# EAGLE design Attenuverting mixer mutes (EAGLE 7.7.0)
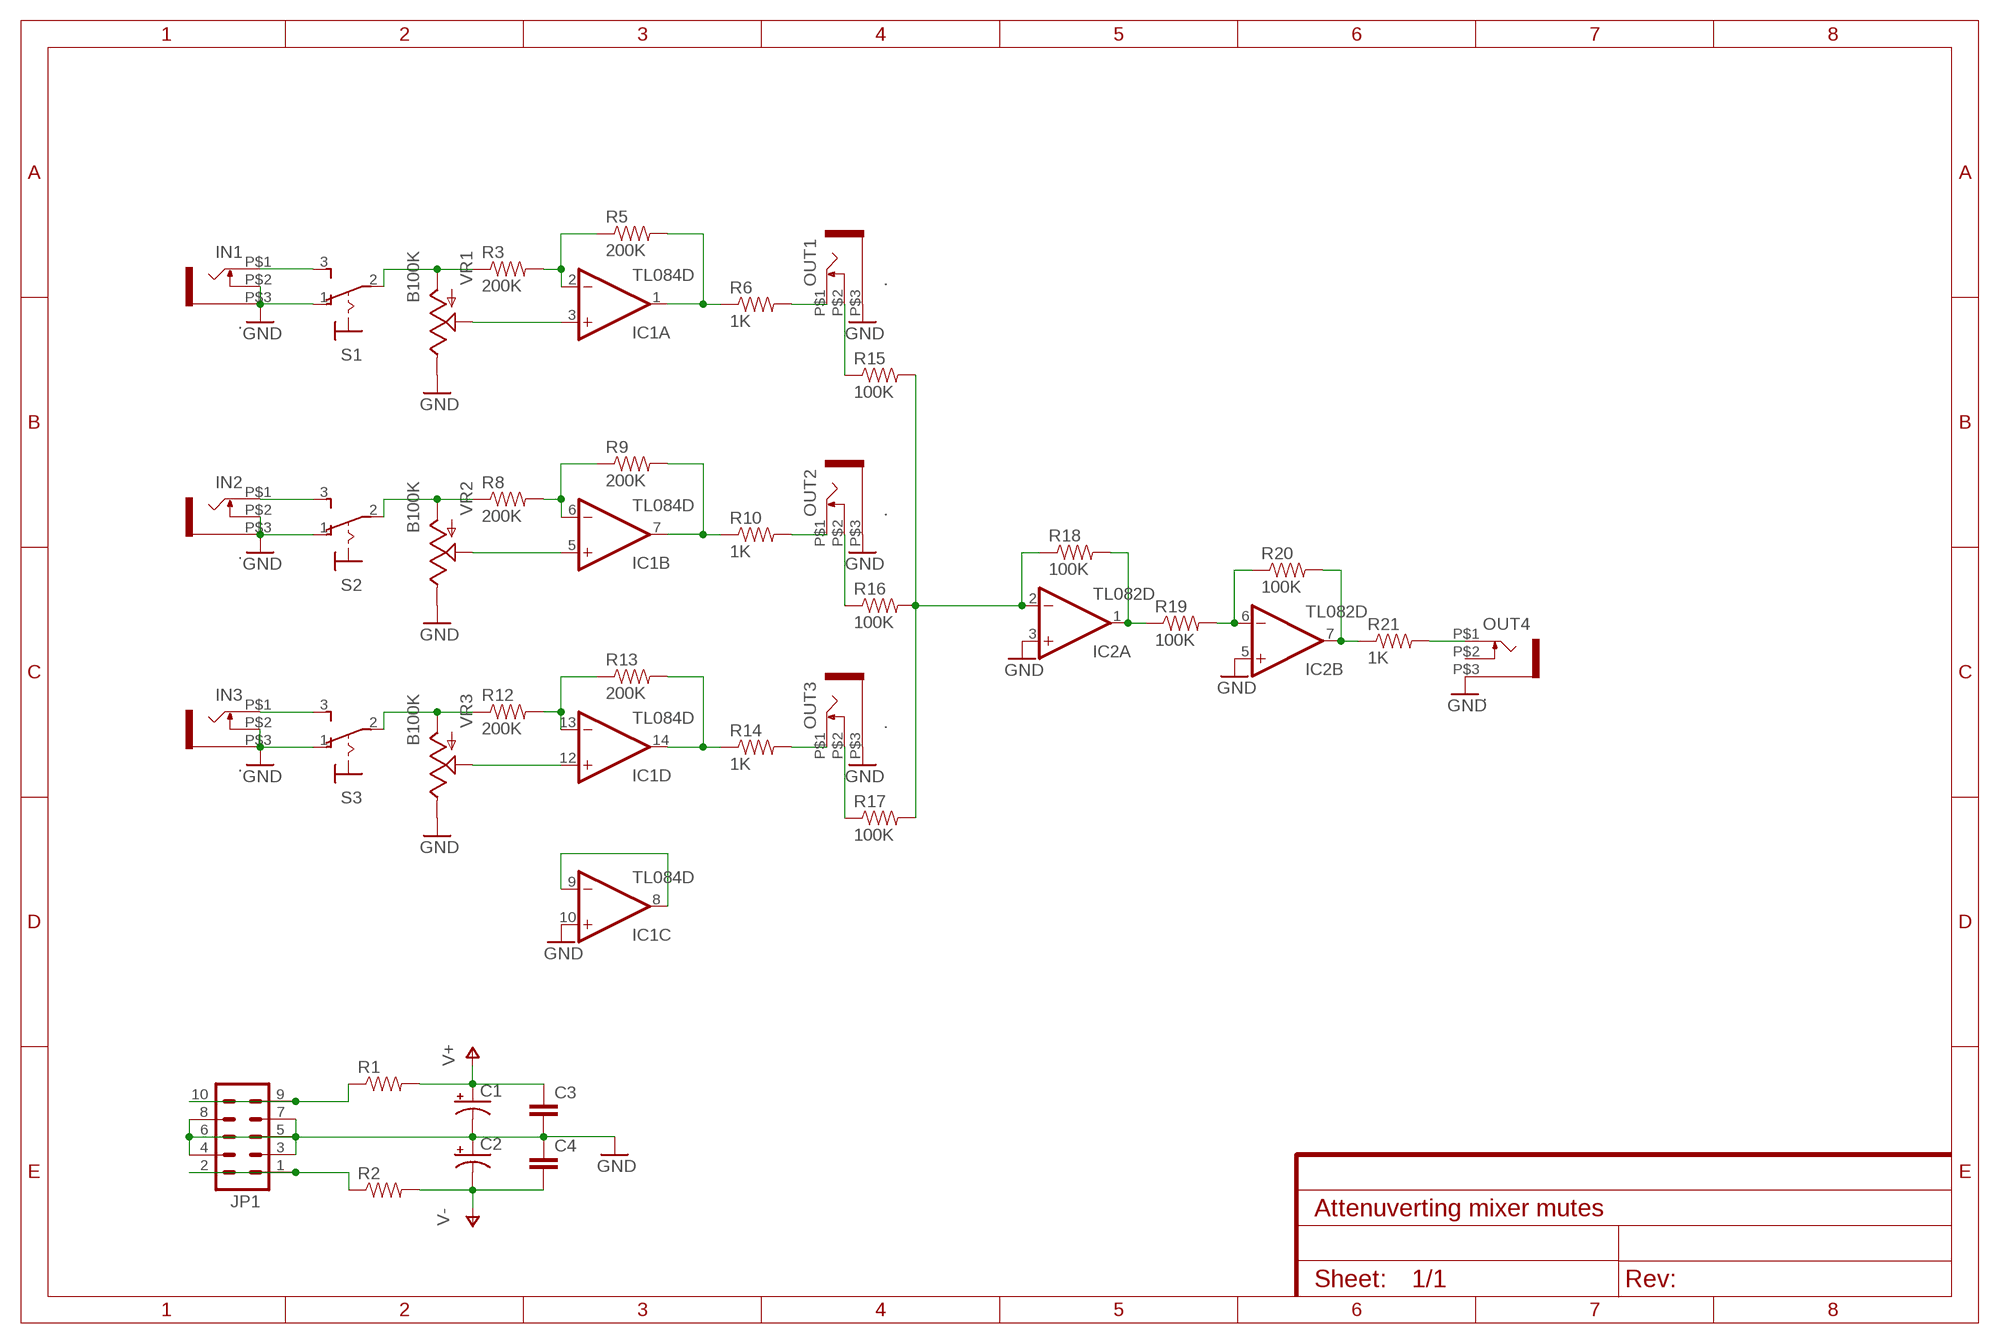
[diagram p0: schematic, sheet 1]

## Parts
C1  CAP_POLD  [PANASONIC_D]
C2  CAP_POLD  [PANASONIC_D]
C3  CAP0603-CAP  [0603-CAP]
C4  CAP0603-CAP  [0603-CAP]
IC1  TL084D  [SO14]
IC2  TL082D  [SO08]
IN1  .  WQP-PJ301M-12_JACK  [WQP-PJ301M-12_JACK]
IN2  .  WQP-PJ301M-12_JACK  [WQP-PJ301M-12_JACK]
IN3  .  WQP-PJ301M-12_JACK  [WQP-PJ301M-12_JACK]
JP1  M05X2PTH  [AVR_ICSP]
OUT1  .  WQP-PJ301M-12_JACK  [WQP-PJ301M-12_JACK]
OUT2  .  WQP-PJ301M-12_JACK  [WQP-PJ301M-12_JACK]
OUT3  .  WQP-PJ301M-12_JACK  [WQP-PJ301M-12_JACK]
OUT4  .  WQP-PJ301M-12_JACK  [WQP-PJ301M-12_JACK]
R1  RESISTOR0805-RES  [0805]
R2  RESISTOR0805-RES  [0805]
R3  200K  RESISTOR0603-RES  [0603-RES]
R5  200K  RESISTOR0603-RES  [0603-RES]
R6  1K  RESISTOR0603-RES  [0603-RES]
R8  200K  RESISTOR0603-RES  [0603-RES]
R9  200K  RESISTOR0603-RES  [0603-RES]
R10  1K  RESISTOR0603-RES  [0603-RES]
R12  200K  RESISTOR0603-RES  [0603-RES]
R13  200K  RESISTOR0603-RES  [0603-RES]
R14  1K  RESISTOR0603-RES  [0603-RES]
R15  100K  RESISTOR0603-RES  [0603-RES]
R16  100K  RESISTOR0603-RES  [0603-RES]
R17  100K  RESISTOR0603-RES  [0603-RES]
R18  100K  RESISTOR0603-RES  [0603-RES]
R19  100K  RESISTOR0603-RES  [0603-RES]
R20  100K  RESISTOR0603-RES  [0603-RES]
R21  1K  RESISTOR0603-RES  [0603-RES]
S1  M9040P  [M9040P]
S2  M9040P  [M9040P]
S3  M9040P  [M9040P]
VR1  B100K  POT  [ALPS_POT]
VR2  B100K  POT  [ALPS_POT]
VR3  B100K  POT  [ALPS_POT]

## Nets
GND: C1.- C2.+ C3.2 C4.1 IC1.10(C:+IN) IC2.3(A:+IN) IC2.5(B:+IN) IN1.P$2 IN1.P$3 IN2.P$2 IN2.P$3 IN3.P$2 IN3.P$3 JP1.3 JP1.4 JP1.5 JP1.6 JP1.7 JP1.8 OUT1.P$3 OUT2.P$3 OUT3.P$3 OUT4.P$3 S1.1(O) S2.1(O) S3.1(O) VR1.P$1(E) VR2.P$1(E) VR3.P$1(E)
N$1: R3.1 S1.2(P) VR1.P$3(A)
N$2: IC1.2(A:-IN) R3.2 R5.1
N$3: JP1.1 JP1.2 R2.1
N$4: JP1.9 JP1.10 R1.1
N$5: OUT3.P$1 R14.2
N$6: OUT2.P$1 R10.2
N$7: OUT1.P$1 R6.2
N$8: IC1.1(A:OUT) R5.2 R6.1
N$9: IC1.3(A:+IN) VR1.P$2(S)
N$10: R8.1 S2.2(P) VR2.P$3(A)
N$11: IC1.6(B:-IN) R8.2 R9.1
N$12: IC1.5(B:+IN) VR2.P$2(S)
N$13: IC1.7(B:OUT) R9.2 R10.1
N$14: R12.1 S3.2(P) VR3.P$3(A)
N$15: IC1.12(D:+IN) VR3.P$2(S)
N$16: IC1.13(D:-IN) R12.2 R13.1
N$17: IC1.14(D:OUT) R13.2 R14.1
N$18: OUT1.P$2 R15.1
N$19: OUT2.P$2 R16.1
N$20: OUT3.P$2 R17.1
N$21: IC2.2(A:-IN) R15.2 R16.2 R17.2 R18.1
N$22: IC2.1(A:OUT) R18.2 R19.1
N$23: IC2.6(B:-IN) R19.2 R20.1
N$24: IC2.7(B:OUT) R20.2 R21.1
N$25: OUT4.P$1 R21.2
N$26: IC1.8(C:OUT) IC1.9(C:-IN)
N$27: IN3.P$1 S3.3(S)
N$28: IN2.P$1 S2.3(S)
N$31: IN1.P$1 S1.3(S)
V+: C1.+ C3.1 R1.2
V-: C2.- C4.2 R2.2
Unconnected: OUT4.P$2

## Power pins joined to a net without a drawn wire
V+: IC1.4(P:V+) IC2.8(P:V+)
V-: IC1.11(P:V-) IC2.4(P:V-)

## Library data of the parts
C1 C2 = SparkFun-Capacitors:CAP_POL: Capacitor Polarized These are standard SMD and PTH capacitors. Normally 10uF, 47uF, and 100uF in electrolytic and tantalum varieties. Always verify the external diameter of the through hole cap, it varies with capacity, voltage, and manufacturer. The EIA devices should be standard.
C3 C4 = SparkFun-Passives:CAP: Capacitor Standard 0603 ceramic capacitor, and 0.1" leaded capacitor.
IC1 = linear:TL084: OP AMP
IC2 = linear:TL082: OP AMP Data sheet <http://www.ti.com/lit/ds/symlink/tl084a . pdf>; DATA_SHEET: <a href="http://www.ti.com/lit/ds/symlink/tl084a.pdf"> Data sheet </a>
IN1-IN3 OUT1-OUT4 = thonkiconn:WQP-PJ301M-12_JACK
JP1 = SparkFun-Connectors:M05X2: Header 5x2 Standard 10-pin dual row 0.1" header. Commonly used with AVR-ISP. Use with Spark Fun Electronics SKU: PRT-00778
R1 R2 = SparkFun-Resistors:RESISTOR: Resistor Basic schematic elements and footprints for 0603, 1206, and PTH resistors.
R3 R5 R6 R8-R10 R12-R21 = SparkFun-Passives:RESISTOR: Resistor Basic schematic elements and footprints for 0603, 1206, and PTH resistors.
S1-S3 = switch:M9040P: TOGGLE SWITCH Marquardt
VR1-VR3 = SparkFun-Electromechanical:POT; PROD_ID: RES-09177

## Board
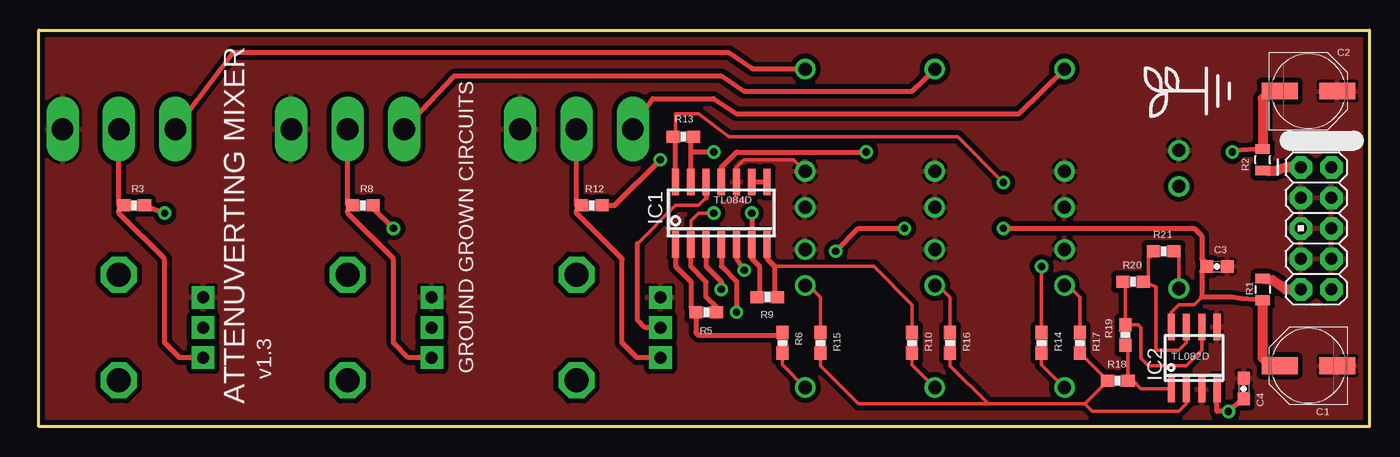
[diagram p1: board, top side]
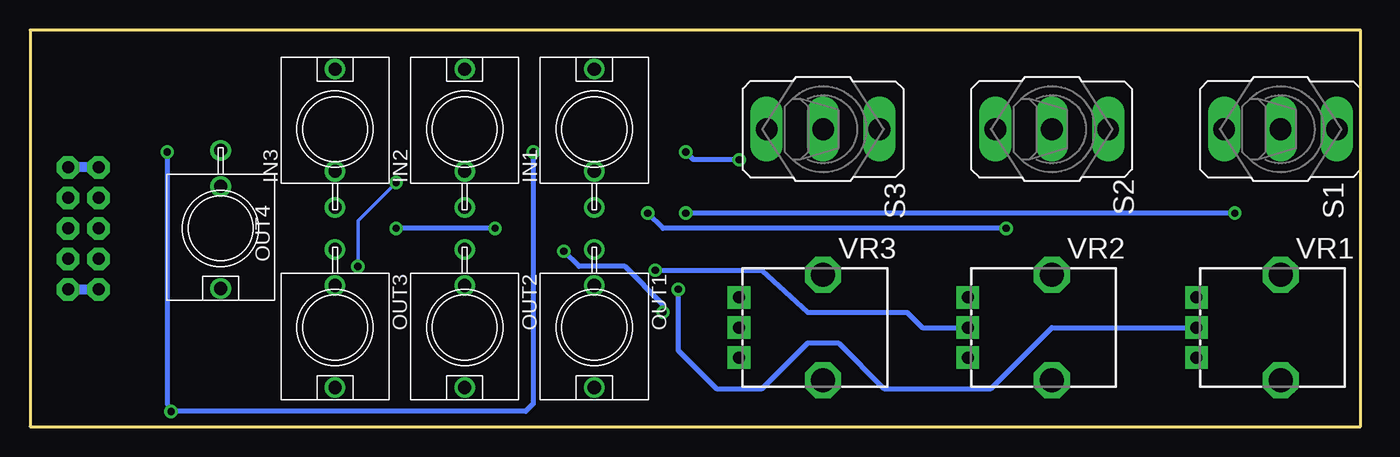
[diagram p2: board, bottom side, seen from below]

Size 110.81 x 33.02 mm. Coordinates in mm from the lower left corner, seen from the top.
Outline: 0,0 0,33.02 110.81,33.02 110.81,0 0,0
Copper layers (1*16): Top 0.035mm / dielectric 1.5mm / Bottom 0.035mm
Design rules "SparkFun": minimum track width 8mil, minimum drill 20mil, track to track 8mil, track to pad 8mil, pad to pad 8mil, via to via 8mil, smd to smd 8mil, copper to edge 8mil, drill to drill 8mil, minimum pad ring 12mil, minimum via ring 10mil, stop-mask expansion 4mil, vias tented up to drill 20mil, thermal gap 10mil

### Footprints (pad centres in the part's own frame; a part is rotated, then mirrored left to right if it is on the bottom)
PANASONIC_D = smd 3 x 1.4: + 2.4,0; - -2.4,0
0603-CAP = smd 1.1 x 1: 1 -0.85,0; 2 0.85,0
SO14 = smd 0.6 x 2.2: 1 -3.81,-2.6; 2 -2.54,-2.6; 3 -1.27,-2.6; 4 0,-2.6; 5 1.27,-2.6; 6 2.54,-2.6; 7 3.81,-2.6; 8 3.81,2.6; 9 2.54,2.6; 10 1.27,2.6; 11 0,2.6; 12 -1.27,2.6; 13 -2.54,2.6; 14 -3.81,2.6
SO08 = smd 0.6 x 2.2: 1 -1.905,-2.6; 2 -0.635,-2.6; 3 0.635,-2.6; 4 1.905,-2.6; 5 1.905,2.6; 6 0.635,2.6; 7 -0.635,2.6; 8 -1.905,2.6
WQP-PJ301M-12_JACK = drill 1.1: P$1 0,5; P$2 0,-3.5; P$3 0,-6.5
AVR_ICSP = drill 1.016 pad 1.88 octagon: 1 -1.27,5.08; 2 1.27,5.08; 3 -1.27,2.54; 4 1.27,2.54; 5 -1.27,0; 6 1.27,0; 7 -1.27,-2.54; 8 1.27,-2.54; 9 -1.27,-5.08; 10 1.27,-5.08
0805 = smd 0.8 x 1.2: 1 -0.9,0; 2 0.9,0
0603-RES = smd 1.1 x 1: 1 -0.85,0; 2 0.85,0
M9040P = drill 1.803 long: 1 0,4.699; 2 0,0; 3 0,-4.699
ALPS_POT = drill 1 pad 1.88 square: P$1 7,-2.5; P$2 7,0; P$3 7,2.5 | drill 2 octagon: P$4 0,-4.4; P$5 0,4.4

### Placement (x,y rotation side)
C1  105.73,5.08 180 top
C2  105.73,27.94 0 top
C3  98.11,13.34 0 top
C4  100.33,3.17 270 top
IC1  56.83,17.78 0 top
IC2  96.2,5.71 0 top
IN1  63.82,24.77 0 bottom
IN2  74.61,24.77 0 bottom
IN3  85.41,24.77 0 bottom
JP1  106.36,16.51 0 top
OUT1  63.82,8.26 180 bottom
OUT2  74.61,8.26 180 bottom
OUT3  85.41,8.26 180 bottom
OUT4  94.93,16.51 180 bottom
R1  101.92,11.43 270 top
R2  101.92,22.23 90 top
R3  7.94,18.41 0 top
R5  55.56,9.53 180 top
R6  61.91,6.99 270 top
R8  26.99,18.41 0 top
R9  60.64,10.79 0 top
R10  72.71,6.99 270 top
R12  46.04,18.41 0 top
R13  53.66,24.13 180 top
R14  83.5,6.99 270 top
R15  65.09,6.99 270 top
R16  75.88,6.99 270 top
R17  86.68,6.99 270 top
R18  89.85,3.81 0 top
R19  90.49,7.62 90 top
R20  91.12,12.06 0 top
R21  93.66,14.61 0 top
S1  6.67,24.77 270 bottom
S2  25.72,24.77 270 bottom
S3  44.77,24.77 270 bottom
U$1  [LOGO_SMALL]  97.16,27.94 90 top
VR1  6.67,8.26 180 bottom
VR2  25.72,8.26 180 bottom
VR3  44.77,8.26 180 bottom

### Tracks (layer width: path | path; a pad name or v marks a point on that pad's centre or on a via)
GND
  Top 0.305: IC1.10 58.1,21.59 58.74,22.23 62.86,22.23 IN1.P$2
  pour Top (isolate 0.406): 0.32,0 0.32,33.02 110.81,33.02 110.81,0
N$1
  Top 0.406: VR1.P$3 11.71,5.75 10.48,6.99 10.48,13.97 6.67,17.78 6.67,18 R3.1 6.67,18.41 S1.2
N$2  (via drill 0.6)
  Top 0.305: IC1.2 54.29,17.14 54.93,17.78 v56.2,17.78
  Top 0.406: R3.2 v10.48,17.78 | R5.1 56.41,9.95 55.56,10.79 55.56,12.06 54.29,13.34 IC1.2
  Bottom 0.406: v10.48,17.78 v56.2,17.78
N$3
  Top 0.813: JP1.1 103.82,21.59 102.87,21.27 102.36,21.27 R2.1
  Bottom 0.813: JP1.1 JP1.2
N$4
  Top 0.813: R1.1 102.74,12.2 103.82,11.43 JP1.9
  Bottom 0.813: JP1.10 JP1.9
N$5
  Top 0.305: R14.2 83.5,5.16 OUT3.P$1
N$6
  Top 0.305: R10.2 72.71,5.16 OUT2.P$1
N$7
  Top 0.305: R6.2 61.91,5.16 OUT1.P$1
N$8
  Top 0.406: IC1.1 53.02,13.34 54.29,12.06 54.29,9.95 R5.2 54.71,7.83 54.93,7.62 61.7,7.62 R6.1
N$9  (via drill 0.6)
  Top 0.406: IC1.3 55.56,13.34 56.83,12.06 v56.83,11.43
  Bottom 0.406: v56.83,11.43 56.83,6.35 53.66,3.17 49.85,3.17 46.04,6.99 43.5,6.99 39.69,3.17 30.8,3.17 25.72,8.26 VR1.P$2
N$10
  Top 0.406: VR2.P$3 30.76,5.75 29.53,6.99 29.53,13.97 25.72,17.78 25.72,18 R8.1 25.72,18.41 S2.2
N$11  (via drill 0.6)
  Top 0.406: R9.1 60.01,11.01 60.01,13.34 59.37,13.97 IC1.6 v59.37,17.78 | R8.2 27.84,18.2 v29.53,16.51
  Bottom 0.406: v29.53,16.51 58.1,16.51 v59.37,17.78
N$12  (via drill 0.6)
  Top 0.406: IC1.5 58.1,13.97 v58.74,13.02
  Bottom 0.406: v58.74,13.02 49.85,13.02 46.04,9.53 37.78,9.53 36.51,8.26 VR2.P$2
N$13
  Top 0.305: R10.1 72.71,10.16 69.53,13.34 61.28,13.34
  Top 0.406: IC1.7 60.64,13.97 61.28,13.34 61.28,11.01 R9.2
N$14
  Top 0.406: VR3.P$3 49.81,5.75 48.58,6.99 48.58,13.97 44.77,17.78 44.77,18 R12.1 44.77,18.41 S3.2
N$15
  Top 0.305: 55.56,19.05 54.93,18.41 53.02,18.41 49.85,15.24
  Top 0.406: IC1.12 55.56,19.05 | VR3.P$2 50.48,8.26 49.85,8.89 49.85,15.24
N$16  (via drill 0.6)
  Top 0.406: IC1.13 54.29,22.86 | 54.29,22.86 54.29,23.91 R13.1 | R12.2 47.94,18.41 v51.75,22.23 | v56.2,22.86 54.29,22.86
  Bottom 0.406: v51.75,22.23 55.56,22.23 v56.2,22.86
N$17  (via drill 0.6)
  Top 0.305: R14.1 v83.5,13.34 | v80.33,20.32 76.52,24.13 57.47,24.13 54.93,26.04 53.02,26.04 53.02,24.13 R13.2
  Top 0.406: IC1.14 53.02,23.91 R13.2
  Bottom 0.305: v83.5,13.34 83.5,17.14 v80.33,20.32
N$18
  Top 0.305: OUT1.P$2 64.13,11.76 65.09,10.79 R15.1
N$19
  Top 0.305: OUT2.P$2 74.92,11.76 75.88,10.79 R16.1
N$20
  Top 0.305: OUT3.P$2 85.72,11.76 86.68,10.79 R17.1
N$21
  Top 0.305: R15.2 65.09,5.08 68.26,1.91 79.06,1.91 | 79.06,1.91 87.1,1.91 | 87.1,1.91 R18.1 R17.2 | R16.2 75.88,5.08 79.06,1.91 | IC2.2 95.57,1.91 94.93,1.27 87.73,1.27 87.1,1.91
N$22
  Top 0.305: IC2.1 94.24,3.17 91.76,3.17 91.12,3.81 R18.2 90.7,6.55 R19.1
N$23
  Top 0.305: R20.1 90.49,11.85 R19.2 91.54,8.47 91.76,8.26 91.76,5.71 92.39,5.08 95.57,5.08 96.84,6.35 IC2.6
N$24
  Top 0.305: IC2.7 95.57,6.99 94.93,6.35 93.03,6.35 93.03,11.64 R20.2 92.39,12.48 92.39,13.97 92.81,14.39 R21.1
N$25
  Top 0.305: OUT4.P$1 94.93,14.19 R21.2
N$26
  Top 0.406: IC1.9 IC1.8
N$27
  Top 0.406: IN3.P$1 81.6,26.04 58.1,26.04 56.2,27.3 51.12,27.3 S3.3
  Bottom 0.406: IN3.P$1 85.33,29.77
N$28
  Top 0.406: IN2.P$1 72.71,27.94 58.74,27.94 56.83,29.21 34.61,29.21 S2.3
  Bottom 0.406: IN2.P$1 74.53,29.77
N$31
  Top 0.406: IN1.P$1 59.45,29.77 | 59.45,29.77 59.37,29.84 | 59.45,29.77 57.47,31.11 16.19,31.11 S1.3
V+  (via drill 0.6)
  Top 0.305: IC2.8 94.3,9.53 94.93,10.16 96.2,10.16 96.84,10.79
  Top 0.406: IC1.4 56.83,13.34 58.1,12.06 v58.1,9.53 | R1.2 100.14,10.66 99.38,10.79 96.84,10.79 96.84,12.91 C3.1 97.26,13.55 96.84,13.97 96.84,15.88 96.2,16.51 v80.33,16.51 | v66.36,14.61 68.26,16.51 v72.07,16.51
  Top 0.813: C1.+ 102.55,5.08 101.92,5.71 R1.2
  Bottom 0.406: v58.1,9.53 58.1,10.16 61.28,13.34 65.09,13.34 v66.36,14.61 | v72.07,16.51 v80.33,16.51
V-  (via drill 0.6)
  Top 0.305: 98.17,3.17 IC2.4
  Top 0.406: R2.2 99.51,22.99 v99.38,22.86 | IC2.4 98.11,1.27 v99.06,1.27 C4.2 | IC1.11 56.83,21.59 58.1,22.86 v68.9,22.86
  Top 0.813: C2.- 102.55,27.94 101.92,27.3 R2.2
  Bottom 0.406: v99.38,22.86 99.38,1.91 v99.06,1.27 69.53,1.27 68.9,1.91 v68.9,22.86

### Text on the board
tPlace: v1.3 | GROUND GROWN CIRCUITS | ATTENUVERTING MIXER
bPlace: VR1 | VR2 | VR3